# Altium project EDA-02267-V6-0_project.PrjPCB (part 3 of 3)

## Sheet drv_single_channel.SchDoc: Fine Delay FMC
size 297 x 209 mm; CheckedBy: B. Civel; CompanyName: CERN; DrawnBy: TW, GK; Engineer: TW; Organization: CERN; Address1: European Organization for Nuclear Research; Address2: CH-1211 Geneve 23 - Switzerland; DocumentNumber: 10; Revision: -; SheetNumber: 10; SheetTotal: 10; Title2: Single output channel; Projet: Fine Delay FMC (FMCDel1ns4cha); ModifiedBy: B. Civel; CreateDate: 19/01/2012; CheckedDate: 06/06/2013; DivGrp: BE-CO; Designer: TW, GK; EDA_Number: EDA-02267-V6-0; PageSetup: Record=PageOptions|CenterHorizontal=True|CenterVertical=True|PrintScale=0.99|XCorrection=1.00|YCorrection=1.00|PrintKind=0|BorderSize=5000000|LeftOffset=0|BottomOffset=0|Orientation=2|PaperLength=1000|PaperWidth=1000|Scale=100|PaperSource=7|PrintQuality=-4|MediaType=1|DitherType=10|PaperKind=A4|PrintScaleMode=1; ModifiedDate: 16/08/2012
Used 4 times, as channels U_OUTPUT_BUFFER/U_drv_single_channel, U_OUTPUT_BUFFER/U_drv_single_channel, U_OUTPUT_BUFFER/U_drv_single_channel, U_OUTPUT_BUFFER/U_drv_single_channel. Parts and nets are listed once, with the designators drawn on the sheet.
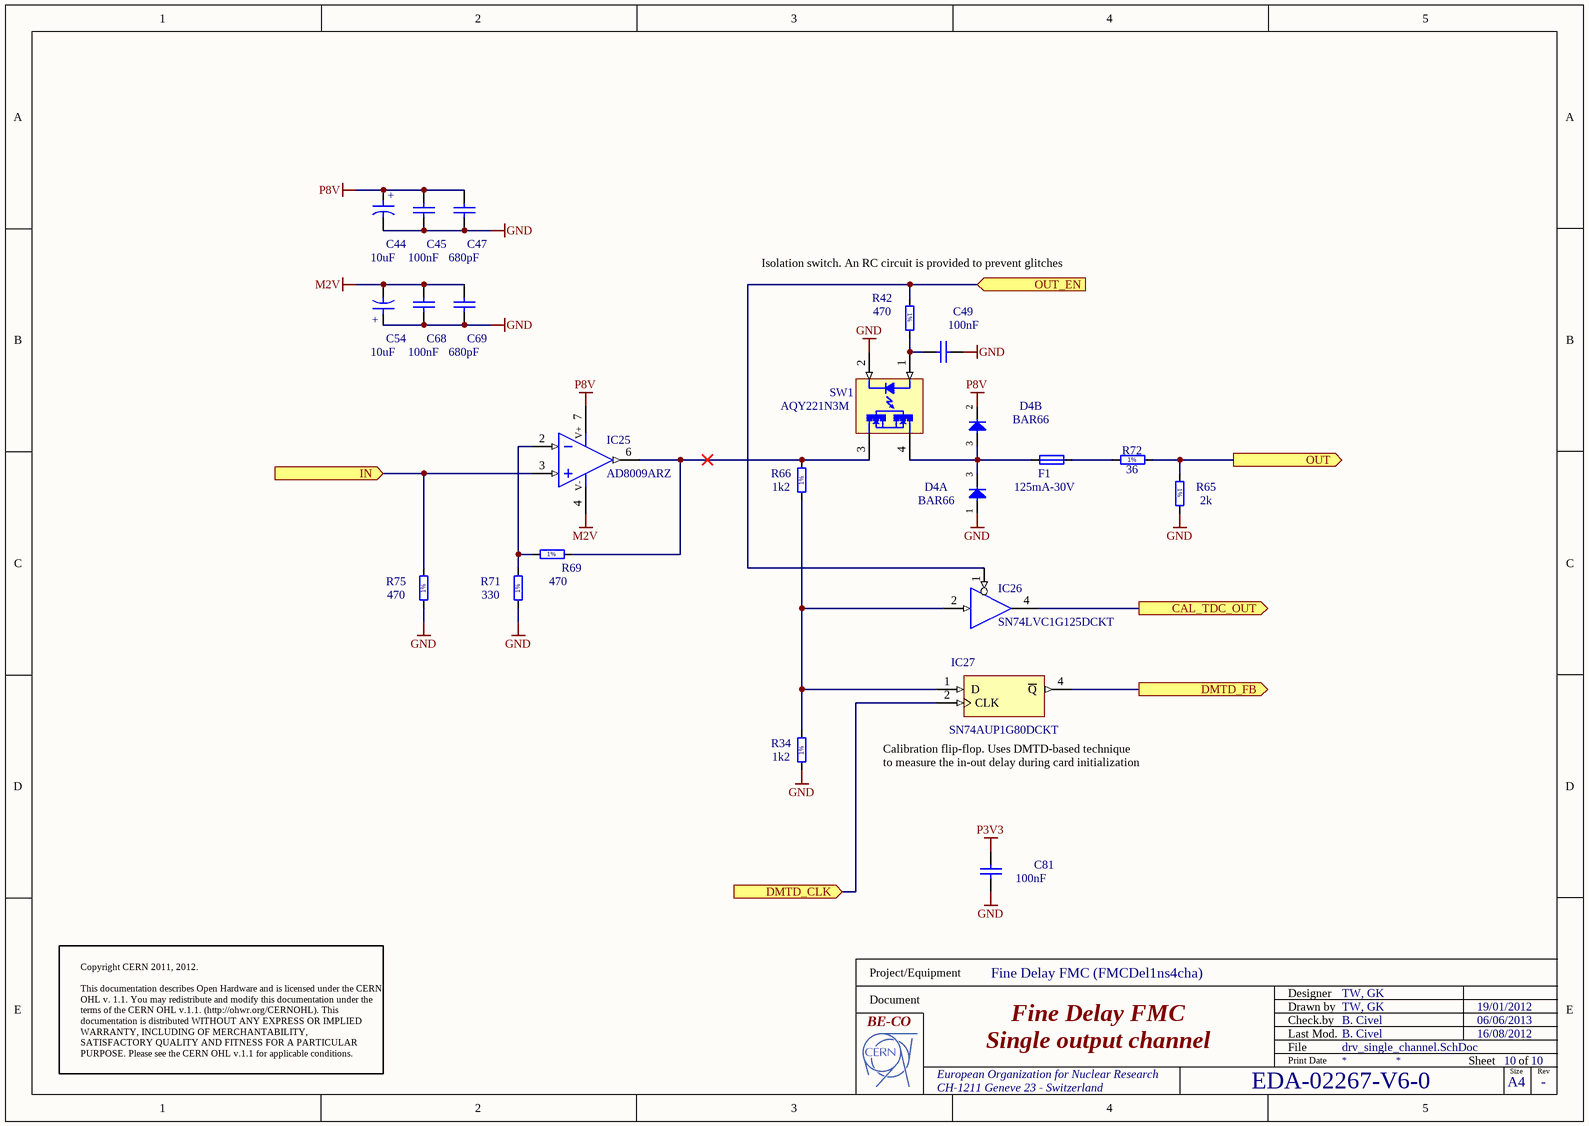
[diagram p7: drv_single_channel.SchDoc]

### Parts
C44  10uF  [CAPMP3528X210N]
C45  100nF  [CAPC1608X87N]
C47  680pF  [CAPC1608X87N]
C49  100nF  [CAPC1608X87N]
C54  10uF  [CAPMP3528X210N]
C68  100nF  [CAPC1608X87N]
C69  680pF  [CAPC1608X87N]
C81  100nF  [CAPC1608X87N]
D4  BAR66  [SOT95P240X110-3N]  (parts A,B of 2)
F1  125mA-30V  [FUSR_LITTELFUSE_1206L012]
IC25  AD8009ARZ  [SOIC127P600X175-8N]
IC26  SN74LVC1G125DCKT  [SOT65P210X110-5N]
IC27  SN74AUP1G80DCKT  [SOT65P210X110-5N]
R34  1k2  [RESC1608X55N]
R42  470  [RESC1608X55N]
R65  2k  [RESC1608X55N]
R66  1k2  [RESC1608X55N]
R69  470  [RESC1608X55N]
R71  330  [RESC1608X55N]
R72  36  [RESC3216X65N]
R75  470  [RESC1608X55N]
SW1  AQY221N3M  [PANASONIC_AQY22(SON)]

### Ports
CAL_TDC_OUT (out), DMTD_CLK (in), DMTD_FB (out), IN (in), OUT (out), OUT_EN (in)

### Nets
GND: C44.2 C45.2 C47.2 C49.1 C54.1 C68.2 C69.2 C81.2 D4.1(A) IC26.3(GND) IC27.3(GND) R34.1 R65.2 R71.1 R75.1 SW1.2(K)
M2V: C54.2 C68.1 C69.1 IC25.4(V-)
P3V3: C81.1 IC26.5(VCC) IC27.5(VCC)
P8V: C44.1 C45.1 C47.1 D4.2(C) IC25.7(V+)
CAL_TDC_OUT: IC26.4(OUT) ; port CAL_TDC_OUT
DMTD_CLK: IC27.2(CLK) ; port DMTD_CLK
DMTD_FB: IC27.4(~{Q}) ; port DMTD_FB
IN: IC25.3(IN+) R75.2 ; port IN
OUT: R65.1 R72.2 ; port OUT
OUT_EN: IC26.1(~{G}) R42.1 ; port OUT_EN
NetC49_2: C49.2 R42.2 SW1.1(A)
NetD4_3: D4.3(COMAC) F1.1 SW1.4(E)
NetF1_2: F1.2 R72.1
NetIC25_2: IC25.2(IN-) R69.1 R71.2
NetIC25_6: IC25.6(OUT) R66.2 R69.2 SW1.3(C)
NetIC26_2: IC26.2(IN) IC27.1(D) R34.2 R66.1

### Channels
U_OUTPUT_BUFFER/U_drv_single_channel: designators end in A; ports CAL_TDC_OUT=TDC_CAL_STOP1 DMTD_CLK=DMTD_CLK_BUF DMTD_FB=NetIC15_2 IN=NetIC1B_6 OUT=NetJ1_1 OUT_EN=OUT_EN1
U_OUTPUT_BUFFER/U_drv_single_channel: designators end in B; ports CAL_TDC_OUT=TDC_CAL_STOP2 DMTD_CLK=DMTD_CLK_BUF DMTD_FB=NetIC15_1 IN=NetIC1B_7 OUT=NetJ2_1 OUT_EN=OUT_EN2
U_OUTPUT_BUFFER/U_drv_single_channel: designators end in C; ports CAL_TDC_OUT=TDC_CAL_STOP3 DMTD_CLK=DMTD_CLK_BUF DMTD_FB=NetIC20_2 IN=NetIC1A_6 OUT=NetJ3_1 OUT_EN=OUT_EN3
U_OUTPUT_BUFFER/U_drv_single_channel: designators end in D; ports CAL_TDC_OUT=TDC_CAL_STOP4 DMTD_CLK=DMTD_CLK_BUF DMTD_FB=NetIC20_1 IN=NetIC1A_7 OUT=NetJ4_1 OUT_EN=OUT_EN4

### Notes on the sheet
- (near R42) Isolation switch. An RC circuit is provided to prevent glitches
- (near IC27) Calibration flip-flop. Uses DMTD-based technique
- to measure the in-out delay during card initialization
- Copyright CERN 2011, 2012.
  This documentation describes Open Hardware and is licensed under the CERN OHL v. 1.1. You may redistribute and modify this documentation under the terms of the CERN OHL v.1.1. (http://ohwr.org/CERNOHL). This documentation is distributed WITHOUT ANY EXPRESS OR IMPLIED WARRANTY, INCLUDING OF MERCHANTABILITY, SATISFACTORY QUALITY AND FITNESS FOR A PARTICULAR PURPOSE. Please see the CERN OHL v.1.1 for applicable conditions.
- Project/Equipment
- Document
- Designer
- Drawn by
- Check.by
- File
- Last Mod.
- Print Date
- Sheet
- Size
- A4
- of
- Rev
- (in symbol CTE3528-21_10UF_16V_20%_SANYO_TQC) +
- (in symbol R0603_1K2_1%_0.1W_100PPM) 1%
- (in symbol R0603_2K_1%_0.1W_100PPM) 1%
- (in symbol R0603_330R_1%_0.1W_100PPM) 1%
- (in symbol R0603_470R_1%_0.1W_100PPM) 1%
- (in symbol R1206_36R_1%_0.25W_100PPM) 1%

### Library data of the parts
C44 C54 = CTE3528-21_10UF_16V_20%_SANYO_TQC: Polarised capacitor; Part Description: ESR 0R1 Solid Tantalum Chip Capacitor; Manufacturer: SANYO; Manufacturer Part Number: 16TQC10M; Voltage: 16V; Tolerance: ±20%; Table: Capacitors SMD; Part Number: CTE3528-21_10UF_16V_20%_SANYO_TQC; Component Kind: Standard; Component Type: Standard; Pin Count: 2; Value: 10uF; Status: None; Case: B; Mounted: Yes; Socket: No; SMD: Yes; ComponentHeight: 2.1mm; HelpURL: \\cern.ch\dfs\Applications\Altium\Datasheets\CTE_SANYO_TQC.pdf; Author: CERN DEM JLC; CreateDate: 6/29/2011; LatestRevisionDate: 6/29/2011
C45 C49 C68 C81 = CC0603_100NF_50V_10%_X7R: Non-polarised capacitor; Part Description: SMD Multilayer Chip Ceramic Capacitor; Manufacturer: GENERIC; Manufacturer1 Part Number: 223858615649; Voltage: 50V; TC: X7R; Tolerance: ±10%; Table: Capacitors SMD; Part Number: CC0603_100NF_50V_10%_X7R; Component Kind: Standard; Component Type: Standard; Pin Count: 2; Value: 100nF; Status: Preferred; Manufacturer Part Number: CC0603_100NF_50V_10%_X7R; Case: 0603; Mounted: Yes; Socket: No; SMD: Yes; Manufacturer1 Example: PHYCOMP; Manufacturer1 ComponentHeight: 0.87mm; HelpURL: \\cern.ch\dfs\Applications\Altium\Datasheets\CC0603_X7R_PHYCOMP.pdf; Author: CERN DEM JLC; CreateDate: 12/3/2007; LatestRevisionDate: 12/3/2007
C47 C69 = CC0603_680PF_50V_5%_NP0: Non-polarised capacitor; Part Description: SMD Multilayer Chip Ceramic Capacitor; Manufacturer: GENERIC; Manufacturer1 Part Number: 223886715681; Voltage: 50V; TC: NP0; Tolerance: ±5%; Table: Capacitors SMD; Part Number: CC0603_680PF_50V_5%_NP0; Component Kind: Standard; Component Type: Standard; Pin Count: 2; Value: 680pF; Status: Preferred; Manufacturer Part Number: CC0603_680PF_50V_5%_NP0; Case: 0603; Mounted: Yes; Socket: No; SMD: Yes; Manufacturer1 Example: PHYCOMP; Manufacturer1 ComponentHeight: 0.87mm; HelpURL: \\cern.ch\dfs\Applications\Altium\Datasheets\CC0603_NP0_PHYCOMP.pdf; Author: CERN DEM JLC; CreateDate: 12/3/2007; LatestRevisionDate: 12/3/2007
D4 = BAR66: Serial Diode; Part Description: Silicon PIN Diode Array (Series Connected); Manufacturer: INFINEON; Voltage: 150V; Power: 250mA; Table: Diodes; Part Number: BAR66; Component Kind: Standard; Component Type: Standard; Device: BAR66; PackageDescription: SOT23 3-Leads, Pitch 0.95mm - Body 1.3x2.9mm, IPC Medium Density; Manufacturer Part Number: BAR66; Pin Count: 3; Mounted: Yes; Socket: No; SMD: Yes; ComponentHeight: 1.1mm; HelpURL: \\cern.ch\dfs\Applications\Altium\Datasheets\BAR66.pdf; Author: CERN DEM JLC; CreateDate: 1/18/2010; LatestRevisionDate: 10/5/2010; Case: SOT23
F1 = FUSR_LITTELFUSE_1206L012: Fuse; Part Description: POLYFUSE® Surface Mount Resettable PTC; Manufacturer Part Number: 1206L012WR; Table: Fuses; Part Number: FUSR_LITTELFUSE_1206L012; Component Kind: Standard; Component Type: Standard; Pin Count: 2; PackageDescription: Surface Mount POLY-FUSE® Resettable PTC, 1206L Series; Family: Fuses Resettable; Mounted: Yes; Socket: No; SMD: Yes; Value: 125mA-30V; Manufacturer: LITTELFUSE; ComponentHeight: 1.45mm; HelpURL: \\cern.ch\dfs\Applications\Altium\Datasheets\FUSR_LITTELFUSE_1206L012.pdf; Author: CERN DEM JLC; CreateDate: 19/12/2011; LatestRevisionDate: 19/12/2011
IC25 = AD8009ARZ: Operational Amplifier; Part Description: 1GHz, 5,500 V/us Low Distortion Amplifier; Manufacturer: ANALOG DEVICES; Table: Operational Amplifiers; Part Number: AD8009ARZ; Component Kind: Standard; Component Type: Standard; Device: AD8009ARZ; PackageDescription: SOIC 8, Pitch 1.27mm - Body 4x5mm, IPC Medium Density; Manufacturer Part Number: AD8009ARZ; Pin Count: 5; Case: SOIC8; Mounted: Yes; Socket: No; SMD: Yes; ComponentHeight: 1.75mm; Author: CERN DEM JLC; HelpURL: \\cern.ch\dfs\Applications\Altium\Datasheets\AD8009ARZ.pdf; CreateDate: 9/29/2010; LatestRevisionDate: 3/24/2011
IC26 = SN74LVC1G125DCKT: Single Bus Buffer Gate With 3-State Output; Manufacturer: TEXAS INSTRUMENTS; Table: Standard Logic; Part Number: SN74LVC1G125DCKT; Component Kind: Standard; Component Type: Standard; Device: SN74LVC1G125DCKT; PackageDescription: SOT353, SC70-5, SOT, 0.65mm Pitch, 5 pin, 1.25mm W X 2.00mm L X 1.10mm H, IPC Medium Density; Part Description: Single Bus Buffer Gate With 3-State Output; Manufacturer Part Number: SN74LVC1G125DCKT; Pin Count: 5; Case: SOT353; Mounted: Yes; Socket: No; SMD: Yes; ComponentHeight: 1.1mm; Author: CERN DEM JLC; HelpURL: \\cern.ch\dfs\Applications\Altium\Datasheets\SN74LVC1G125DCKT.pdf; CreateDate: 12/19/2011; LatestRevisionDate: 12/19/2011
IC27 = SN74AUP1G80DCKT: Single Positive-Edge-Triggered D-Type Flip-Flop; Part Description: Low-Power Single Positive-Edge-Triggered D-Type Flip-Flop; Manufacturer: TEXAS INSTRUMENTS; Table: Standard Logic; Part Number: SN74AUP1G80DCKT; Component Kind: Standard; Component Type: Standard; Device: SN74AUP1G80DCKT; PackageDescription: SOT353, SC70-5, SOT, 0.65mm Pitch, 5 pin, 1.25mm W X 2.00mm L X 1.10mm H, IPC Medium Density; Manufacturer Part Number: SN74AUP1G80DCKT; Pin Count: 5; Case: SOT353; Mounted: Yes; Socket: No; SMD: Yes; ComponentHeight: 1.1mm; Author: CERN DEM JLC; HelpURL: \\cern.ch\dfs\Applications\Altium\Datasheets\SN74AUP1G80DCKT.pdf; CreateDate: 12/19/2011; LatestRevisionDate: 12/19/2011
R34 R66 = R0603_1K2_1%_0.1W_100PPM: Resistor - 1%; Part Description: General Purpose Thick Film Chip Resistor; Manufacturer: GENERIC; Manufacturer1 Part Number: NRC06F1201TRF; Power: 0.1W; TC: ±100ppm/°C; Table: Resistors SMD; Part Number: R0603_1K2_1%_0.1W_100PPM; Component Kind: Standard; Component Type: Standard; Pin Count: 2; Value: 1k2; Status: Preferred; Tolerance: ±1%; Manufacturer Part Number: R0603_1K2_1%_0.1W_100PPM; Case: 0603; Mounted: Yes; Socket: No; SMD: Yes; Manufacturer1 Example: NIC COMPONENT; Manufacturer1 ComponentHeight: 0.55mm; HelpURL: \\cern.ch\dfs\Applications\Altium\Datasheets\R0603_NIC_NRC.pdf; Author: CERN DEM JLC; CreateDate: 12/3/2007; LatestRevisionDate: 3/13/2008
R42 R69 R75 = R0603_470R_1%_0.1W_100PPM: Resistor - 1%; Part Description: General Purpose Thick Film Chip Resistor; Manufacturer: GENERIC; Manufacturer1 Part Number: NRC06F4700TRF; Power: 0.1W; TC: ±100ppm/°C; Table: Resistors SMD; Part Number: R0603_470R_1%_0.1W_100PPM; Component Kind: Standard; Component Type: Standard; Pin Count: 2; Value: 470; Status: Preferred; Tolerance: ±1%; Manufacturer Part Number: R0603_470R_1%_0.1W_100PPM; Case: 0603; Mounted: Yes; Socket: No; SMD: Yes; Manufacturer1 Example: NIC COMPONENT; Manufacturer1 ComponentHeight: 0.55mm; HelpURL: \\cern.ch\dfs\Applications\Altium\Datasheets\R0603_NIC_NRC.pdf; Author: CERN DEM JLC; CreateDate: 12/3/2007; LatestRevisionDate: 3/13/2008
R65 = R0603_2K_1%_0.1W_100PPM: Resistor - 1%; Part Description: General Purpose Thick Film Chip Resistor; Manufacturer: GENERIC; Manufacturer1 Part Number: NRC06F2001TRF; Power: 0.1W; TC: ±100ppm/°C; Table: Resistors SMD; Part Number: R0603_2K_1%_0.1W_100PPM; Component Kind: Standard; Component Type: Standard; Pin Count: 2; Value: 2k; Status: Preferred; Tolerance: ±1%; Manufacturer Part Number: R0603_2K_1%_0.1W_100PPM; Case: 0603; Mounted: Yes; Socket: No; SMD: Yes; Manufacturer1 Example: NIC COMPONENT; Manufacturer1 ComponentHeight: 0.55mm; HelpURL: \\cern.ch\dfs\Applications\Altium\Datasheets\R0603_NIC_NRC.pdf; Author: CERN DEM JLC; CreateDate: 12/3/2007; LatestRevisionDate: 3/13/2008
R71 = R0603_330R_1%_0.1W_100PPM: Resistor - 1%; Part Description: General Purpose Thick Film Chip Resistor; Manufacturer: GENERIC; Manufacturer1 Part Number: NRC06F3300TRF; Power: 0.1W; TC: ±100ppm/°C; Table: Resistors SMD; Part Number: R0603_330R_1%_0.1W_100PPM; Component Kind: Standard; Component Type: Standard; Pin Count: 2; Value: 330; Status: Preferred; Tolerance: ±1%; Manufacturer Part Number: R0603_330R_1%_0.1W_100PPM; Case: 0603; Mounted: Yes; Socket: No; SMD: Yes; Manufacturer1 Example: NIC COMPONENT; Manufacturer1 ComponentHeight: 0.55mm; HelpURL: \\cern.ch\dfs\Applications\Altium\Datasheets\R0603_NIC_NRC.pdf; Author: CERN DEM JLC; CreateDate: 12/3/2007; LatestRevisionDate: 3/13/2008
R72 = R1206_36R_1%_0.25W_100PPM: Resistor - 1%; Part Description: General Purpose Thick Film Chip Resistor; Manufacturer: GENERIC; Manufacturer1 Part Number: NRC12F36R0TRF; Power: 0.25W; TC: ±100ppm/°C; Table: Resistors SMD; Part Number: R1206_36R_1%_0.25W_100PPM; Component Kind: Standard; Component Type: Standard; Pin Count: 2; Value: 36; Status: Preferred; Tolerance: ±1%; Manufacturer Part Number: R1206_36R_1%_0.25W_100PPM; Case: 1206; Mounted: Yes; Socket: No; SMD: Yes; Manufacturer1 Example: NIC COMPONENT; Manufacturer1 ComponentHeight: 0.65mm; HelpURL: \\cern.ch\dfs\Applications\Altium\Datasheets\R1206_NIC_NRC.pdf; Author: CERN DEM JLC; CreateDate: 12/3/2007; LatestRevisionDate: 3/13/2008
SW1 = AQY221N3M: PhotoMOS Relay; Part Description: Micro-miniature SON Package Lower Output Capacitance and On Resistance (C×R5) 25V Load Voltage PhotoMOS Relay; Manufacturer: PANASONIC ELECTRIC WORKS; Table: Optocouplers; Part Number: AQY221N3M; Component Kind: Standard; Component Type: Standard; Device: AQY221N3M; PackageDescription: PANASONIC Serie AQY22(SON)  Small Outline No Lead, 4 pins, 2.2x2.95mm; Manufacturer Part Number: AQY221N3M; Pin Count: 4; Case: SON4; Mounted: Yes; Socket: No; SMD: Yes; ComponentHeight: 1.4mm; HelpURL: \\cern.ch\dfs\Applications\Altium\Datasheets\AQY221N3M.pdf; ComponentLink1Description: Package Drawing; ComponentLink1URL: \\cern.ch\dfs\Applications\Altium\Datasheets\AQY221N3M_Package-Drawing.pdf; Author: CERN DEM JLC; CreateDate: 1/18/2010; LatestRevisionDate: 1/18/2010

## Sheet input_stage.SchDoc: Fine Delay FMC
size 297 x 209 mm; CheckedBy: B. Civel; CompanyName: CERN; DrawnBy: TW, GK; Engineer: TW; Organization: CERN; Address1: European Organization for Nuclear Research; Address2: CH-1211 Geneve 23 - Switzerland; DocumentNumber: 6; Revision: -; SheetNumber: 6; SheetTotal: 10; ModifiedBy: B. Civel; CreateDate: 19/01/2012; CheckedDate: 06/06/2013; Title2: Input stage logic; Designer: TW, GK; EDA_Number: EDA-02267-V6-0; Projet: Fine Delay FMC (FMCDel1ns4cha); DivGrp: BE-CO; ModifiedDate: 16/08/2012
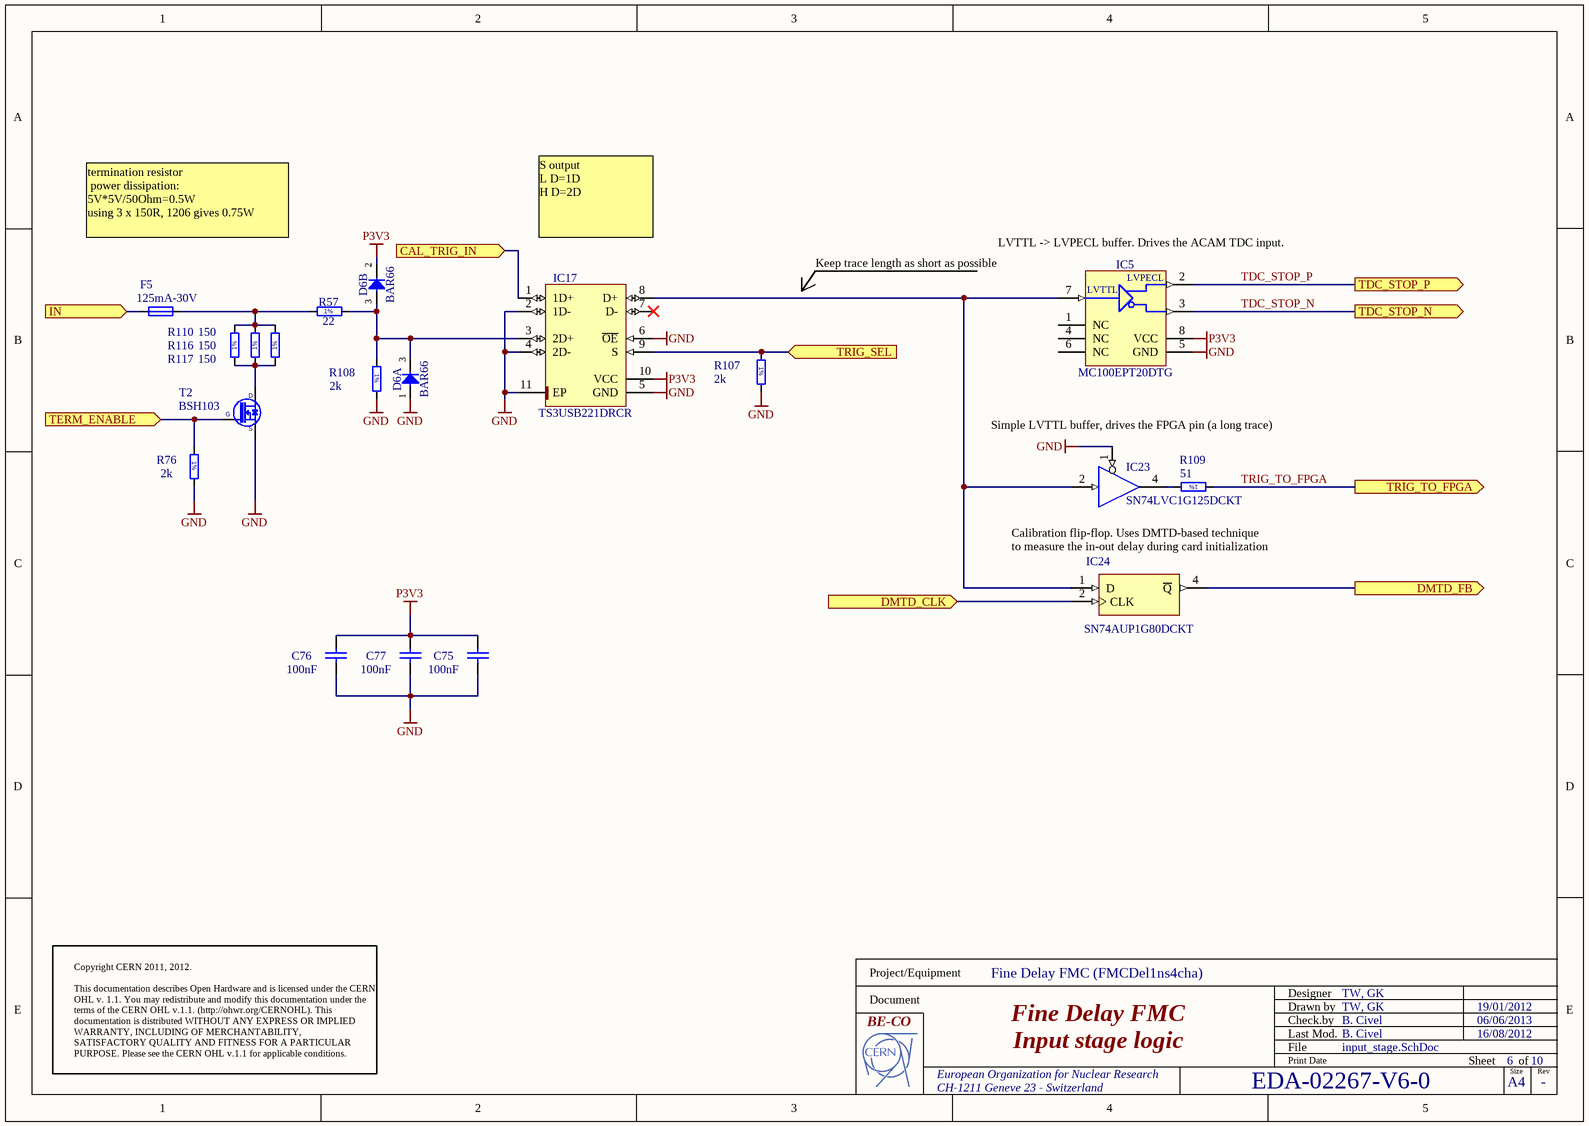
[diagram p8: input_stage.SchDoc]

### Parts
C75  100nF  [CAPC1608X87N]
C76  100nF  [CAPC1608X87N]
C77  100nF  [CAPC1608X87N]
D6  BAR66  [SOT95P240X110-3N]  (parts A,B of 2)
F5  125mA-30V  [FUSR_LITTELFUSE_1206L012]
IC5  MC100EPT20DTG  [SOP65P490X110-8N]
IC17  TS3USB221DRCR  [TEXAS_DRC (S-PVSON-N10)]
IC23  SN74LVC1G125DCKT  [SOT65P210X110-5N]
IC24  SN74AUP1G80DCKT  [SOT65P210X110-5N]
R57  22  [RESC1608X55N]
R76  2k  [RESC1608X55N]
R107  2k  [RESC1608X55N]
R108  2k  [RESC1608X55N]
R109  51  [RESC1608X55N]
R110  150  [RESC3216X65N]
R116  150  [RESC3216X65N]
R117  150  [RESC3216X65N]
T2  BSH103  [SOT95P230X110-3N]

### Ports
CAL_TRIG_IN (in), DMTD_CLK (in), DMTD_FB (out), IN (in), TDC_STOP_N (out), TDC_STOP_P (out), TERM_ENABLE (in), TRIG_SEL (in), TRIG_TO_FPGA (out)

### Nets
GND: C75.2 C76.2 C77.2 D6.1(A) IC5.5(GND) IC17.2(1D-) IC17.4(2D-) IC17.5(GND) IC17.6(~{OE}) IC17.11(EP) IC23.1(~{G}) IC23.3(GND) IC24.3(GND) R76.2 R107.2 R108.2 T2.2(S)
P3V3: C75.1 C76.1 C77.1 D6.2(C) IC5.8(VCC) IC17.10(VCC) IC23.5(VCC) IC24.5(VCC)
CAL_PULSE_BUF: IC17.1(1D+) ; port CAL_TRIG_IN
DMTD_CLK_BUF: IC24.2(CLK) ; port DMTD_CLK
DMTD_FB_IN: IC24.4(~{Q}) ; port DMTD_FB
TDC_STOP_N: IC5.3(~{Q}) ; port TDC_STOP_N
TDC_STOP_P: IC5.2(Q) ; port TDC_STOP_P
TERM_ENABLE: R76.1 T2.1(G) ; port TERM_ENABLE
TRIG_SEL: IC17.9(S) R107.1 ; port TRIG_SEL
TRIG_TO_FPGA: R109.1 ; port TRIG_TO_FPGA
NetD6_3: D6.3(COMAC) IC17.3(2D+) R57.2 R108.1
NetF5_1: F5.1 ; port IN
NetF5_2: F5.2 R57.1 R110.2 R116.2 R117.2
NetIC5_7: IC5.7(D) IC17.8(D+) IC23.2(IN) IC24.1(D)
NetIC23_4: IC23.4(OUT) R109.2
NetR110_1: R110.1 R116.1 R117.1 T2.3(D)

Not connected (* = marked no-connect by the designer): IC5 1(NC) 4(NC) 6(NC); IC17 7(D-)*

### Notes on the sheet
- termination resistor
  power dissipation:
  5V*5V/50Ohm=0.5W
  using 3 x 150R, 1206 gives 0.75W
- S	output
  L	D=1D
  H	D=2D
- (near IC5) Keep trace length as short as possible
- (near IC5) LVTTL -> LVPECL buffer. Drives the ACAM TDC input.
- Simple LVTTL buffer, drives the FPGA pin (a long trace)
- Calibration flip-flop. Uses DMTD-based technique
- to measure the in-out delay during card initialization
- Copyright CERN 2011, 2012.
  This documentation describes Open Hardware and is licensed under the CERN OHL v. 1.1. You may redistribute and modify this documentation under the terms of the CERN OHL v.1.1. (http://ohwr.org/CERNOHL). This documentation is distributed WITHOUT ANY EXPRESS OR IMPLIED WARRANTY, INCLUDING OF MERCHANTABILITY, SATISFACTORY QUALITY AND FITNESS FOR A PARTICULAR PURPOSE. Please see the CERN OHL v.1.1 for applicable conditions.
- Project/Equipment
- Document
- Designer
- Drawn by
- Check.by
- File
- Last Mod.
- Print Date
- Sheet
- Size
- A4
- of
- Rev
- (in symbol MC100EPT20DTG) LVPECL; LVTTL
- (in symbol R0603_2K_1%_0.1W_100PPM) 1%
- (in symbol R0603_22R_1%_0.1W_100PPM) 1%
- (in symbol R0603_51R_1%_0.1W_100PPM) 1%
- (in symbol R1206_150R_1%_0.25W_100PPM) 1%

### Library data of the parts
C75-C77 = CC0603_100NF_50V_10%_X7R: as C45 on sheet drv_single_channel; Part Number: CC0603_100NF_50V_10%_X7R; Component Kind: Standard; Component Type: Standard; Pin Count: 2; Value: 100nF; Status: Preferred; Manufacturer Part Number: CC0603_100NF_50V_10%_X7R; Case: 0603; Mounted: Yes; Socket: No; SMD: Yes; Manufacturer1 Example: PHYCOMP; Manufacturer1 ComponentHeight: 0.87mm; HelpURL: \\cern.ch\dfs\Applications\Altium\Datasheets\CC0603_X7R_PHYCOMP.pdf; Author: CERN DEM JLC; CreateDate: 12/3/2007; LatestRevisionDate: 12/3/2007
D6 = BAR66: as D4 on sheet drv_single_channel; Part Number: BAR66; Component Kind: Standard; Component Type: Standard; Device: BAR66; PackageDescription: SOT23 3-Leads, Pitch 0.95mm - Body 1.3x2.9mm, IPC Medium Density; Manufacturer Part Number: BAR66; Pin Count: 3; Case: SOT23; Mounted: Yes; Socket: No; SMD: Yes; ComponentHeight: 1.1mm; HelpURL: \\cern.ch\dfs\Applications\Altium\Datasheets\BAR66.pdf; Author: CERN DEM JLC; CreateDate: 18/01/2010; LatestRevisionDate: 05/10/2010
F5 = FUSR_LITTELFUSE_1206L012: as F1 on sheet drv_single_channel; Part Number: FUSR_LITTELFUSE_1206L012; Component Kind: Standard; Component Type: Standard; Pin Count: 2; PackageDescription: Surface Mount POLY-FUSE® Resettable PTC, 1206L Series; Family: Fuses Resettable; Mounted: Yes; Socket: No; SMD: Yes; Value: 125mA-30V; Manufacturer: LITTELFUSE; ComponentHeight: 1.45mm; HelpURL: \\cern.ch\dfs\Applications\Altium\Datasheets\FUSR_LITTELFUSE_1206L012.pdf; Author: CERN DEM JLC; CreateDate: 19/12/2011; LatestRevisionDate: 19/12/2011
IC5 = MC100EPT20DTG: 3.3V LVTTL/LVCMOS to Differential LVPECL Translator; Manufacturer: ON SEMICONDUCTOR; Table: Standard Logic; Part Number: MC100EPT20DTG; Component Kind: Standard; Component Type: Standard; Device: MC100EPT20DTG; PackageDescription: SOP, 0.65mm pitch; 8 pin, 3.00mm W X 3.00mm L X 1.10mm H body, IPC Medium Density; Part Description: 3.3V LVTTL/LVCMOS To Differential LVPECL Translator; Manufacturer Part Number: MC100EPT20DTG; Pin Count: 8; Case: SOIC8; Mounted: Yes; Socket: No; SMD: Yes; ComponentHeight: 1.1mm; Author: CERN DEM JLC; HelpURL: \\cern.ch\dfs\Applications\Altium\Datasheets\MC100EPT20DTG.pdf; CreateDate: 7/5/2010; LatestRevisionDate: 7/5/2010
IC17 = TS3USB221DRCR: High-Speed USB 2.0 (480-Mbps) 1:2 Multiplexer/Demultiplexer Switch With Single Enable; Manufacturer: TEXAS INSTRUMENTS; Table: Analog & Interface; Part Number: TS3USB221DRCR; Component Kind: Standard; Component Type: Standard; Device: TS3USB221DRCR; PackageDescription: SON, TEXAS DRC (S-PVSON-N10), 0.50mm Pitch, 10-pin, 3.00mm W  X 3.00mm L X 1.00mm Height, (w/thermal tab 1.65 X 2.40 mm); Part Description: High-Speed USB 2.0 (480-Mbps) 1:2 Multiplexer/Demultiplexer Switch With Single Enable; Manufacturer Part Number: TS3USB221DRCR; Pin Count: 11; Case: SON10; Mounted: Yes; Socket: No; SMD: Yes; ComponentHeight: 1mm; Author: CERN DEM JLC; HelpURL: \\cern.ch\dfs\Applications\Altium\Datasheets\TS3USB221DRCR.pdf; CreateDate: 25/08/2010; LatestRevisionDate: 06/11/2013
IC23 = SN74LVC1G125DCKT: as IC26 on sheet drv_single_channel; Part Number: SN74LVC1G125DCKT; Component Kind: Standard; Component Type: Standard; Device: SN74LVC1G125DCKT; PackageDescription: SOT353, SC70-5, SOT, 0.65mm Pitch, 5 pin, 1.25mm W X 2.00mm L X 1.10mm H, IPC Medium Density; Part Description: Single Bus Buffer Gate With 3-State Output; Manufacturer Part Number: SN74LVC1G125DCKT; Pin Count: 5; Case: SOT353; Mounted: Yes; Socket: No; SMD: Yes; ComponentHeight: 1.1mm; Author: CERN DEM JLC; HelpURL: \\cern.ch\dfs\Applications\Altium\Datasheets\SN74LVC1G125DCKT.pdf; CreateDate: 12/19/2011; LatestRevisionDate: 12/19/2011
IC24 = SN74AUP1G80DCKT: as IC27 on sheet drv_single_channel; Part Number: SN74AUP1G80DCKT; Component Kind: Standard; Component Type: Standard; Device: SN74AUP1G80DCKT; PackageDescription: SOT353, SC70-5, SOT, 0.65mm Pitch, 5 pin, 1.25mm W X 2.00mm L X 1.10mm H, IPC Medium Density; Manufacturer Part Number: SN74AUP1G80DCKT; Pin Count: 5; Case: SOT353; Mounted: Yes; Socket: No; SMD: Yes; ComponentHeight: 1.1mm; Author: CERN DEM JLC; HelpURL: \\cern.ch\dfs\Applications\Altium\Datasheets\SN74AUP1G80DCKT.pdf; CreateDate: 12/19/2011; LatestRevisionDate: 12/19/2011
R57 = R0603_22R_1%_0.1W_100PPM: Resistor - 1%; Part Description: General Purpose Thick Film Chip Resistor; Manufacturer: GENERIC; Manufacturer1 Part Number: NRC06F22R0TRF; Power: 0.1W; TC: ±100ppm/°C; Table: Resistors SMD; Part Number: R0603_22R_1%_0.1W_100PPM; Component Kind: Standard; Component Type: Standard; Pin Count: 2; Value: 22; Status: Preferred; Tolerance: ±1%; Manufacturer Part Number: R0603_22R_1%_0.1W_100PPM; Case: 0603; Mounted: Yes; Socket: No; SMD: Yes; Manufacturer1 Example: NIC COMPONENT; Manufacturer1 ComponentHeight: 0.55mm; HelpURL: \\cern.ch\dfs\Applications\Altium\Datasheets\R0603_NIC_NRC.pdf; Author: CERN DEM JLC; CreateDate: 03/12/2007; LatestRevisionDate: 13/03/2008
R76 R107 R108 = R0603_2K_1%_0.1W_100PPM: as R65 on sheet drv_single_channel; Part Number: R0603_2K_1%_0.1W_100PPM; Component Kind: Standard; Component Type: Standard; Pin Count: 2; Value: 2k; Status: Preferred; Tolerance: ±1%; Manufacturer Part Number: R0603_2K_1%_0.1W_100PPM; Case: 0603; Mounted: Yes; Socket: No; SMD: Yes; Manufacturer1 Example: NIC COMPONENT; Manufacturer1 ComponentHeight: 0.55mm; HelpURL: \\cern.ch\dfs\Applications\Altium\Datasheets\R0603_NIC_NRC.pdf; Author: CERN DEM JLC; CreateDate: 12/3/2007; LatestRevisionDate: 3/13/2008
R109 = R0603_51R_1%_0.1W_100PPM: as R1-R8 on sheet delay_channel; Part Number: R0603_51R_1%_0.1W_100PPM; Component Kind: Standard; Component Type: Standard; Pin Count: 2; Value: 51; Status: Preferred; Tolerance: ±1%; Manufacturer Part Number: R0603_51R_1%_0.1W_100PPM; Case: 0603; Mounted: Yes; Socket: No; SMD: Yes; Manufacturer1 Example: NIC COMPONENT; Manufacturer1 ComponentHeight: 0.55mm; HelpURL: \\cern.ch\dfs\Applications\Altium\Datasheets\R0603_NIC_NRC.pdf; Author: CERN DEM JLC; CreateDate: 12/3/2007; LatestRevisionDate: 3/13/2008
R110 R116 R117 = R1206_150R_1%_0.25W_100PPM: Resistor - 1%; Part Description: General Purpose Thick Film Chip Resistor; Manufacturer: GENERIC; Manufacturer1 Part Number: NRC12F1500TRF; Power: 0.25W; TC: ±100ppm/°C; Table: Resistors SMD; Part Number: R1206_150R_1%_0.25W_100PPM; Component Kind: Standard; Component Type: Standard; Pin Count: 2; Value: 150; Status: Preferred; Tolerance: ±1%; Manufacturer Part Number: R1206_150R_1%_0.25W_100PPM; Case: 1206; Mounted: Yes; Socket: No; SMD: Yes; Manufacturer1 Example: NIC COMPONENT; Manufacturer1 ComponentHeight: 0.65mm; HelpURL: \\cern.ch\dfs\Applications\Altium\Datasheets\R1206_NIC_NRC.pdf; Author: CERN DEM JLC; CreateDate: 12/3/2007; LatestRevisionDate: 3/13/2008
T2 = BSH103: N-CHANNEL MOSFET WITH DIODE; Part Description: 30V 850mA N-Channel Enhancement Mode Field-Effect Transistor; Manufacturer: NXP SEMICONDUCTORS; Table: Transistors; Part Number: BSH103; Component Kind: Standard; Component Type: Standard; Device: BSH103; PackageDescription: SOT23, 3 pin, Pitch 0.95mm - 1.3mm W X 2.9mm L X 1.1mm H, IPC Medium Density; Manufacturer Part Number: BSH103; Pin Count: 3; Case: SOT23-3; Mounted: Yes; Socket: No; SMD: Yes; ComponentHeight: 1.1mm; HelpURL: \\cern.ch\dfs\Applications\Altium\Datasheets\BSH103.pdf; Author: CERN DEM JLC; CreateDate: 3/16/2010; LatestRevisionDate: 2/1/2012

## Sheet leds_mem_sensor.SchDoc: Fine Delay FMC
size 297 x 209 mm; CheckedBy: B. Civel; CompanyName: CERN; DrawnBy: TW, GK; Engineer: TW; Organization: CERN; Address1: European Organization for Nuclear Research; Address2: CH-1211 Geneve 23 - Switzerland; DocumentNumber: 4; Revision: -; SheetNumber: 4; SheetTotal: 10; ModifiedBy: B. Civel; CreateDate: 18/01/2012; CheckedDate: 06/06/2013; Title2: LEDs, sensors and ID EEPROM; Designer: TW, GK; EDA_Number: EDA-02267-V6-1; Projet: Fine Delay FMC (FMCDel1ns4cha); DivGrp: BE-CO; ModifiedDate: 16/08/2012
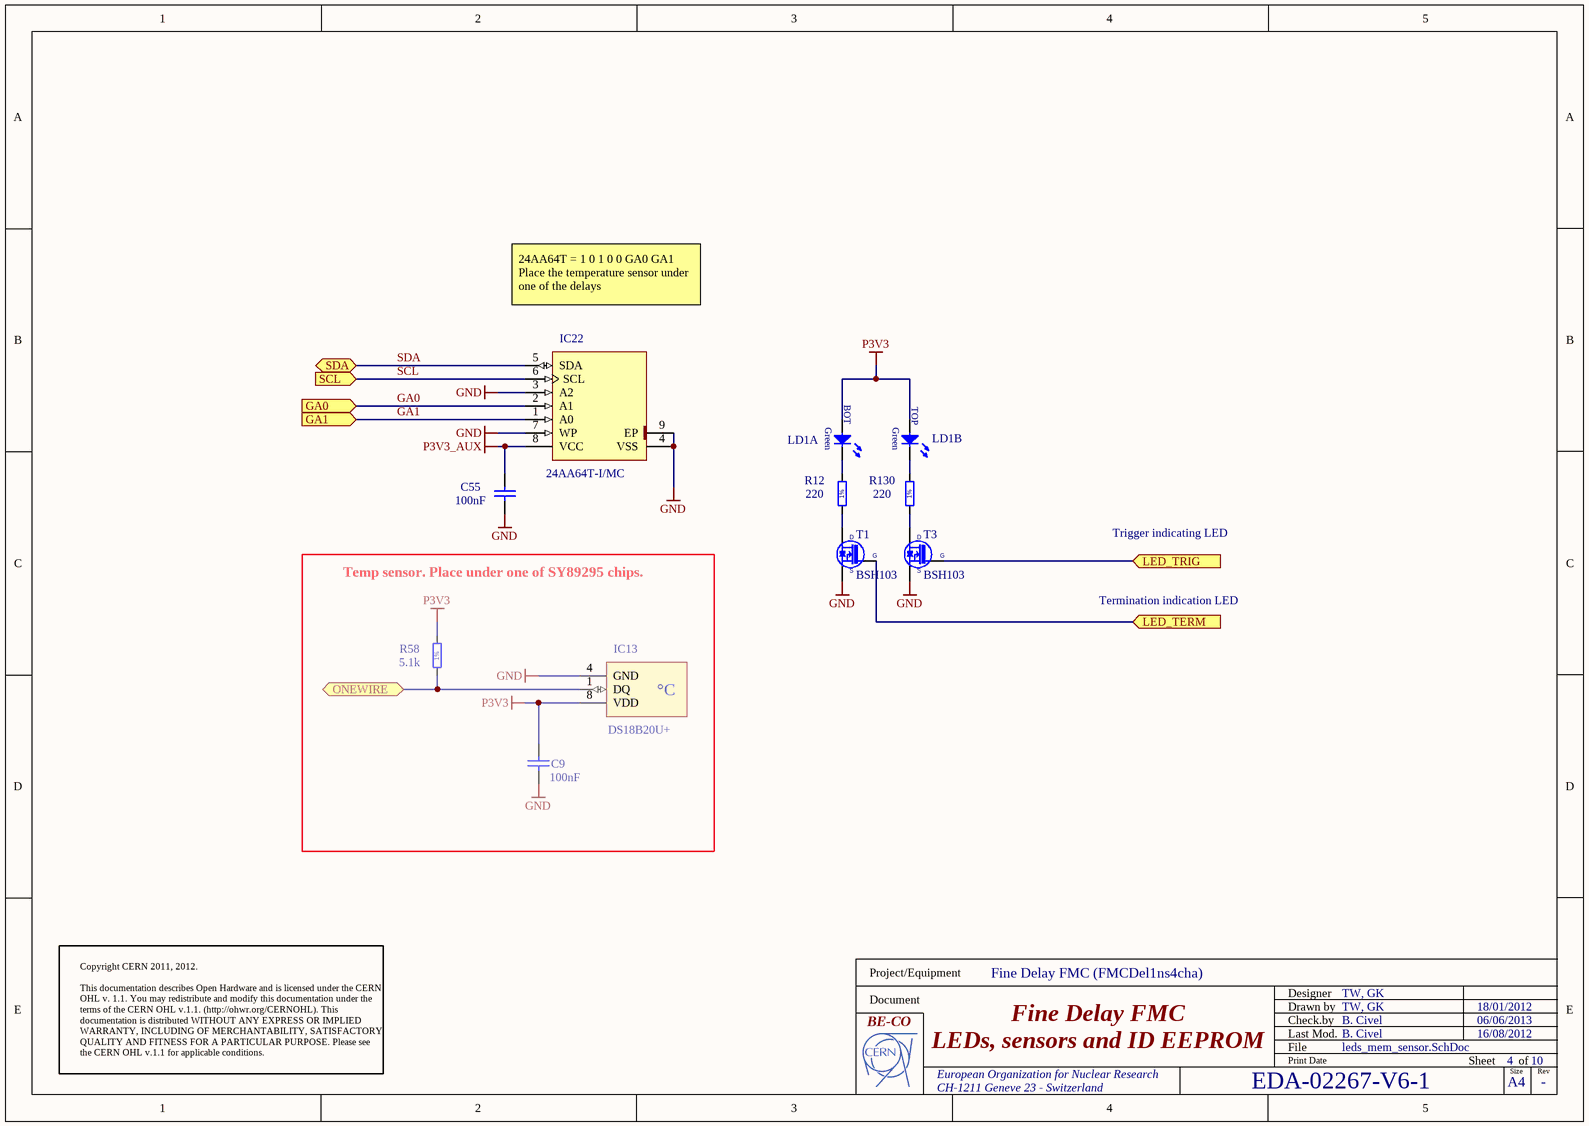
[diagram p9: leds_mem_sensor.SchDoc]

### Parts
C9  100nF  [CAPC1608X87N]
C55  100nF  [CAPC1608X87N]
IC13  DS18B20U+  [SOP65P490X110-8N]
IC22  24AA64T-I/MC  [SON50P300X200X100-9N-S175X155]
LD1  Green/Green  [LED_DIALIGHT_571-0122-100F]  (value not drawn)  (parts A,B of 2)
R12  220  [RESC1608X55N]
R58  5.1k  [RESC1608X55N]
R130  220  [RESC1608X55N]
T1  BSH103  [SOT95P230X110-3N]
T3  BSH103  [SOT95P230X110-3N]

### Blocks framed on the sheet
Temp sensor. Place under one of SY89295 chips.: C9 IC13 R58

### Ports
GA0 (in), GA1 (in), LED_TERM (in), LED_TRIG (in), ONEWIRE (bidir), SCL (in), SDA (bidir)

### Nets
GND: C9.2 C55.2 IC13.4(GND) IC22.3(A2) IC22.4(VSS) IC22.7(WP) IC22.9(EP) T1.2(S) T3.2(S)
P3V3: C9.1 IC13.8(VDD) LD1.2(A) LD1.4(A) R58.2
P3V3_AUX: C55.1 IC22.8(VCC)
GA0: IC22.2(A1) ; port GA0
GA1: IC22.1(A0) ; port GA1
SCL: IC22.6(SCL) ; port SCL
SDA: IC22.5(SDA) ; port SDA
TERM_ENABLE: T1.1(G) ; port LED_TERM
NetIC13_1: IC13.1(DQ) R58.1 ; port ONEWIRE
NetJ6_h19: T3.1(G) ; port LED_TRIG
NetLD1_1: LD1.1(C) R12.2
NetLD1_3: LD1.3(C) R130.2
NetR12_1: R12.1 T1.3(D)
NetR130_1: R130.1 T3.3(D)

### Notes on the sheet
- 24AA64T = 1 0 1 0 0 GA0 GA1
  Place the temperature sensor under one of the delays
- Trigger indicating LED
- Termination indication LED
- Copyright CERN 2011, 2012.
  This documentation describes Open Hardware and is licensed under the CERN OHL v. 1.1. You may redistribute and modify this documentation under the terms of the CERN OHL v.1.1. (http://ohwr.org/CERNOHL). This documentation is distributed WITHOUT ANY EXPRESS OR IMPLIED WARRANTY, INCLUDING OF MERCHANTABILITY, SATISFACTORY QUALITY AND FITNESS FOR A PARTICULAR PURPOSE. Please see the CERN OHL v.1.1 for applicable conditions.
- Project/Equipment
- Document
- Designer
- Drawn by
- Check.by
- File
- Last Mod.
- Print Date
- Sheet
- Size
- A4
- of
- Rev
- (in symbol DS18B20U+) °C
- (in symbol LED_DIALIGHT_571-0122-100F, part A) BOT; Green
- (in symbol LED_DIALIGHT_571-0122-100F, part B) TOP; Green
- (in symbol R0603_5K1_1%_0.1W_100PPM) 1%
- (in symbol R0603_220R_1%_0.1W_100PPM) 1%

### Library data of the parts
C9 C55 = CC0603_100NF_50V_10%_X7R: as C45 on sheet drv_single_channel; Part Number: CC0603_100NF_50V_10%_X7R; Component Kind: Standard; Component Type: Standard; Pin Count: 2; Value: 100nF; Status: Preferred; Manufacturer Part Number: CC0603_100NF_50V_10%_X7R; Case: 0603; Mounted: Yes; Socket: No; SMD: Yes; Manufacturer1 Example: PHYCOMP; Manufacturer1 ComponentHeight: 0.87mm; HelpURL: \\cern.ch\dfs\Applications\Altium\Datasheets\CC0603_X7R_PHYCOMP.pdf; Author: CERN DEM JLC; CreateDate: 03/12/2007; LatestRevisionDate: 03/12/2007
IC13 = DS18B20U+: Programmable Resolution 1-Wire Digital Thermometer; Part Description: Programmable Resolution 1-Wire Digital Thermometer (-55°C to +125°C); Manufacturer: DALLAS MAXIM; Table: Sensors; PressFit: No; Bonding: No; Part Number: DS18B20U+; Component Kind: Standard; Component Type: Standard; Device: DS18B20U+; PackageDescription: SOP, 0.65mm pitch; 8 pin, 3.00mm W X 3.00mm L X 1.10mm H body, IPC Medium Density; Manufacturer Part Number: DS18B20U+; Pin Count: 3; Case: uSOP8; Mounted: Yes; Socket: No; SMD: Yes; ComponentHeight: 1.1mm; HelpURL: \\cern.ch\dfs\Applications\Altium\Datasheets\DS18B20U+.pdf; Author: CERN DEM JLC; CreateDate: 17/03/2010; LatestRevisionDate: 02/05/2011
IC22 = 24AA64T-I/MC: 1.7-5.5V 64K I2C Serial EEPROM; Part Description: 1.7V-5.5V, 64K  (8K x 8-bit) I2C Serial EEPROM; Manufacturer: MICROCHIP TECHNOLOGY; Table: Logic; PressFit: No; Bonding: No; Part Number: 24AA64T-I/MC; Component Kind: Standard; Component Type: Standard; Device: 24AA64T-I/MC; PackageDescription: SON (DFN), 0.50mm pitch, 8 pin, 2mm X 3mm X 1.00mm H body (w/thermal tab 1.75 X 1.55mm),  IPC Medium Density; Manufacturer Part Number: 24AA64T-I/MC; Pin Count: 9; Case: DFN8; Mounted: Yes; Socket: No; SMD: Yes; ComponentHeight: 1.0mm; HelpURL: \\cern.ch\dfs\Applications\Altium\Datasheets\24AA64T-I-MC.pdf; Author: CERN DEM JLC; CreateDate: 18/11/2009; LatestRevisionDate: 24/01/2011
LD1 = LED_DIALIGHT_571-0122-100F: LED x2 Green 1C2A-BOT_3C4A-TOP; Part Description: Dual 2mm Green LEDs CBI® Circuit Board Indicator (With positioning pins); Table: LEDs & Displays; PressFit: No; Bonding: No; Part Number: LED_DIALIGHT_571-0122-100F; Component Kind: Standard; Component Type: Standard; Color: Green/Green; PackageDescription: 2x 2mm Red LED PCB Edge Mounting (With positioning pins) DIALIGHT 571 Serie; Manufacturer: DIALIGHT; Manufacturer Part Number: 571-0122-100F; Pin Count: 4; Mounted: Yes; Socket: No; SMD: No; ComponentHeight: 8.6mm; HelpURL: \\cern.ch\dfs\Applications\Altium\Datasheets\LED_DIALIGHT_571-0122-100F.pdf; Author: CERN DEM JLC; CreateDate: 05/11/2009; LatestRevisionDate: 17/03/2010
R12 R130 = R0603_220R_1%_0.1W_100PPM: Resistor - 1%; Part Description: General Purpose Thick Film Chip Resistor; Manufacturer: GENERIC; Manufacturer1 Part Number: NRC06F2200TRF; Power: 0.1W; TC: ±100ppm/°C; Table: Resistors SMD; Part Number: R0603_220R_1%_0.1W_100PPM; Component Kind: Standard; Component Type: Standard; Pin Count: 2; Value: 220; Status: Preferred; Tolerance: ±1%; Manufacturer Part Number: R0603_220R_1%_0.1W_100PPM; Case: 0603; Mounted: Yes; Socket: No; SMD: Yes; Manufacturer1 Example: NIC COMPONENT; Manufacturer1 ComponentHeight: 0.55mm; HelpURL: \\cern.ch\dfs\Applications\Altium\Datasheets\R0603_NIC_NRC.pdf; Author: CERN DEM JLC; CreateDate: 12/3/2007; LatestRevisionDate: 3/13/2008
R58 = R0603_5K1_1%_0.1W_100PPM: Resistor - 1%; Part Description: General Purpose Thick Film Chip Resistor; Manufacturer: GENERIC; Manufacturer1 Part Number: NRC06F5101TRF; Value: 5k1; Power: 0.1W; TC: ±100ppm/°C; Table: Resistors SMD; Part Number: R0603_5K1_1%_0.1W_100PPM; Component Kind: Standard; Component Type: Standard; Designator: Resistor - 1%; Library Reference: Resistor - 1%; Pin Count: 2; Status: Preferred; Tolerance: ±1%; Manufacturer Part Number: R0603_5K1_1%_0.1W_100PPM; Case: 0603; Mounted: Yes; Socket: No; SMD: Yes; Manufacturer1 Example: NIC COMPONENT; Manufacturer1 ComponentHeight: 0.55mm; HelpURL: \\cern.ch\dfs\Applications\Altium\Datasheets\R0603_NIC_NRC.pdf; Author: CERN DEM JLC; CreateDate: 12/3/2007; LatestRevisionDate: 3/13/2008
T1 T3 = BSH103: N-CHANNEL MOSFET WITH DIODE; Part Description: 30V 850mA N-Channel Enhancement Mode Field-Effect Transistor; Manufacturer: NXP SEMICONDUCTORS; Table: Transistors; PressFit: No; Bonding: No; Part Number: BSH103; Component Kind: Standard; Component Type: Standard; Device: BSH103; PackageDescription: SOT23, 3 pin, Pitch 0.95mm - 1.3mm W X 2.9mm L X 1.1mm H, IPC Medium Density; Manufacturer Part Number: BSH103; Pin Count: 3; Case: SOT23-3; Mounted: Yes; Socket: No; SMD: Yes; ComponentHeight: 1.1mm; HelpURL: \\cern.ch\dfs\Applications\Altium\Datasheets\BSH103.pdf; Author: CERN DEM JLC; CreateDate: 16/03/2010; LatestRevisionDate: 01/02/2012

## Nets that join several sheets
GND: FMC_Delay_1ns_4Cha (23 pins), clock_generator (27 pins), fmc_connector (75 pins), power_supply (18 pins), acam_tdc (50 pins), U_CHANNEL_DELAY (36 pins), U_CHANNEL_DELAY (36 pins), output_driver (6 pins), U_OUTPUT_BUFFER/U_drv_single_channel (16 pins), U_OUTPUT_BUFFER/U_drv_single_channel (16 pins), U_OUTPUT_BUFFER/U_drv_single_channel (16 pins), U_OUTPUT_BUFFER/U_drv_single_channel (16 pins), input_stage (17 pins), leds_mem_sensor (9 pins)
M2V: power_supply (C41.1 C43.2 L4.2 R44.2), U_OUTPUT_BUFFER/U_drv_single_channel (C54A.2 C68A.1 C69A.1 IC25A.4), U_OUTPUT_BUFFER/U_drv_single_channel (C54B.2 C68B.1 C69B.1 IC25B.4), U_OUTPUT_BUFFER/U_drv_single_channel (C54C.2 C68C.1 C69C.1 IC25C.4), U_OUTPUT_BUFFER/U_drv_single_channel (C54D.2 C68D.1 C69D.1 IC25D.4)
P3V3: FMC_Delay_1ns_4Cha (14 pins), clock_generator (L3.1 L17.1), fmc_connector (11 pins), power_supply (D1.1 IC16.2 IC16.8), acam_tdc (6 pins), U_CHANNEL_DELAY (20 pins), U_CHANNEL_DELAY (20 pins), output_driver (5 pins), U_OUTPUT_BUFFER/U_drv_single_channel (C81A.1 IC26A.5 IC27A.5), U_OUTPUT_BUFFER/U_drv_single_channel (C81B.1 IC26B.5 IC27B.5), U_OUTPUT_BUFFER/U_drv_single_channel (C81C.1 IC26C.5 IC27C.5), U_OUTPUT_BUFFER/U_drv_single_channel (C81D.1 IC26D.5 IC27D.5), input_stage (8 pins), leds_mem_sensor (5 pins)
P3V3_AUX: fmc_connector (J6.d32), leds_mem_sensor (C55.1 IC22.8)
P8V: power_supply (7 pins), acam_tdc (6 pins), U_OUTPUT_BUFFER/U_drv_single_channel (5 pins), U_OUTPUT_BUFFER/U_drv_single_channel (5 pins), U_OUTPUT_BUFFER/U_drv_single_channel (5 pins), U_OUTPUT_BUFFER/U_drv_single_channel (5 pins)
P12V0: fmc_connector (C90.2 C91.2 J6.c35 J6.c37), power_supply (8 pins)
VADJ: fmc_connector (J6.g39 J6.h40), power_supply (R39.1)
CAL_PULSE_BUF: FMC_Delay_1ns_4Cha (IC31.4 R73.1), acam_tdc (IC8.80), input_stage (IC17.1)
CLK1_N: clock_generator (IC4.39), U_CHANNEL_DELAY (IC3A.5 R8A.2)
CLK1_N: clock_generator (IC4.53), U_CHANNEL_DELAY (IC3B.5 R8B.2)
CLK1_P: clock_generator (IC4.40), U_CHANNEL_DELAY (IC3A.4 R10A.2)
CLK1_P: clock_generator (IC4.52), U_CHANNEL_DELAY (IC3B.4 R10B.2)
CLK2_N: clock_generator (IC4.43), U_CHANNEL_DELAY (IC3A.7 R14A.2)
CLK2_N: clock_generator (IC4.56), U_CHANNEL_DELAY (IC3B.7 R14B.2)
CLK2_P: clock_generator (IC4.42), U_CHANNEL_DELAY (IC3A.6 R21A.2)
CLK2_P: clock_generator (IC4.55), U_CHANNEL_DELAY (IC3B.6 R21B.2)
CLK125_N: clock_generator (IC4.35), fmc_connector (J6.g3)
CLK125_P: clock_generator (IC4.36), fmc_connector (J6.g2)
DELAY_D0: fmc_connector (J6.h38), U_CHANNEL_DELAY (IC2A.23 IC7A.2), U_CHANNEL_DELAY (IC2B.23 IC7B.2)
DELAY_D1: fmc_connector (J6.h37), U_CHANNEL_DELAY (IC2A.25 IC7A.1), U_CHANNEL_DELAY (IC2B.25 IC7B.1)
DELAY_D2: fmc_connector (J6.g37), U_CHANNEL_DELAY (IC2A.26 IC7A.32), U_CHANNEL_DELAY (IC2B.26 IC7B.32)
DELAY_D3: fmc_connector (J6.g36), U_CHANNEL_DELAY (IC2A.27 IC7A.31), U_CHANNEL_DELAY (IC2B.27 IC7B.31)
DELAY_D4: fmc_connector (J6.h35), U_CHANNEL_DELAY (IC2A.29 IC7A.30), U_CHANNEL_DELAY (IC2B.29 IC7B.30)
DELAY_D5: fmc_connector (J6.h34), U_CHANNEL_DELAY (IC2A.30 IC7A.29), U_CHANNEL_DELAY (IC2B.30 IC7B.29)
DELAY_D6: fmc_connector (J6.g34), U_CHANNEL_DELAY (IC2A.31 IC7A.27), U_CHANNEL_DELAY (IC2B.31 IC7B.27)
DELAY_D7: fmc_connector (J6.g33), U_CHANNEL_DELAY (IC2A.32 IC7A.26), U_CHANNEL_DELAY (IC2B.32 IC7B.26)
DELAY_D8: fmc_connector (J6.h32), U_CHANNEL_DELAY (IC2A.1 IC7A.25), U_CHANNEL_DELAY (IC2B.1 IC7B.25)
DELAY_D9: fmc_connector (J6.h31), U_CHANNEL_DELAY (IC2A.2 IC7A.23), U_CHANNEL_DELAY (IC2B.2 IC7B.23)
DELAY_LEN1: fmc_connector (J6.h28), U_CHANNEL_DELAY (IC2A.10)
DELAY_LEN2: fmc_connector (J6.h29), U_CHANNEL_DELAY (IC7A.10)
DELAY_LEN3: fmc_connector (J6.g31), U_CHANNEL_DELAY (IC2B.10)
DELAY_LEN4: fmc_connector (J6.g30), U_CHANNEL_DELAY (IC7B.10)
DIN1: fmc_connector (J6.h26), U_CHANNEL_DELAY (R1A.2)
DIN2: fmc_connector (J6.h25), U_CHANNEL_DELAY (R52A.2)
DIN3: fmc_connector (J6.g28), U_CHANNEL_DELAY (R1B.2)
DIN4: fmc_connector (J6.g27), U_CHANNEL_DELAY (R52B.2)
DMTD_CLK: FMC_Delay_1ns_4Cha (IC32.2), fmc_connector (J6.c22)
DMTD_CLK_BUF: FMC_Delay_1ns_4Cha (IC32.4), output_driver (R74.1), U_OUTPUT_BUFFER/U_drv_single_channel (IC27A.2), U_OUTPUT_BUFFER/U_drv_single_channel (IC27B.2), U_OUTPUT_BUFFER/U_drv_single_channel (IC27C.2), U_OUTPUT_BUFFER/U_drv_single_channel (IC27D.2), input_stage (IC24.2)
DMTD_FB_IN: fmc_connector (J6.g7), input_stage (IC24.4)
DMTD_FB_OUT: fmc_connector (J6.c23), output_driver (IC18.4)
EXT_RESET_N: fmc_connector (J6.g22), power_supply (R78.1)
FPGA_TDC_START_N: clock_generator (C24.1), fmc_connector (J6.h5)
FPGA_TDC_START_P: clock_generator (C12.1), fmc_connector (J6.h4)
GA0: fmc_connector (J6.c34), leds_mem_sensor (IC22.2)
GA1: fmc_connector (J6.d35), leds_mem_sensor (IC22.1)
NetF5_1: FMC_Delay_1ns_4Cha (J5.1), input_stage (F5.1)
NetIC1A_6: U_CHANNEL_DELAY (IC1A.6), U_OUTPUT_BUFFER/U_drv_single_channel (IC25C.3 R75C.2)
NetIC1A_7: U_CHANNEL_DELAY (IC1A.7), U_OUTPUT_BUFFER/U_drv_single_channel (IC25D.3 R75D.2)
NetIC1B_6: U_CHANNEL_DELAY (IC1B.6), U_OUTPUT_BUFFER/U_drv_single_channel (IC25A.3 R75A.2)
NetIC1B_7: U_CHANNEL_DELAY (IC1B.7), U_OUTPUT_BUFFER/U_drv_single_channel (IC25B.3 R75B.2)
NetIC4_46: clock_generator (IC4.46), acam_tdc (IC8.56)
NetIC8_4: fmc_connector (J6.g24), acam_tdc (IC8.4)
NetIC8_5: fmc_connector (J6.g25), acam_tdc (IC8.5 IC8.6 IC8.8 IC8.9)
NetIC13_1: fmc_connector (J6.h20), leds_mem_sensor (IC13.1 R58.1)
NetIC15_1: output_driver (IC15.1), U_OUTPUT_BUFFER/U_drv_single_channel (IC27B.4)
NetIC15_2: output_driver (IC15.2), U_OUTPUT_BUFFER/U_drv_single_channel (IC27A.4)
NetIC20_1: output_driver (IC20.1), U_OUTPUT_BUFFER/U_drv_single_channel (IC27D.4)
NetIC20_2: output_driver (IC20.2), U_OUTPUT_BUFFER/U_drv_single_channel (IC27C.4)
NetIC31_2: FMC_Delay_1ns_4Cha (IC31.2), fmc_connector (J6.h22)
NetJ1_1: FMC_Delay_1ns_4Cha (J1.1), U_OUTPUT_BUFFER/U_drv_single_channel (R65A.1 R72A.2)
NetJ2_1: FMC_Delay_1ns_4Cha (J2.1), U_OUTPUT_BUFFER/U_drv_single_channel (R65B.1 R72B.2)
NetJ3_1: FMC_Delay_1ns_4Cha (J3.1), U_OUTPUT_BUFFER/U_drv_single_channel (R65C.1 R72C.2)
NetJ4_1: FMC_Delay_1ns_4Cha (J4.1), U_OUTPUT_BUFFER/U_drv_single_channel (R65D.1 R72D.2)
NetJ6_g18: fmc_connector (J6.g18), acam_tdc (RN4.9)
NetJ6_g19: fmc_connector (J6.g19), acam_tdc (RN4.11)
NetJ6_h19: fmc_connector (J6.h19), leds_mem_sensor (T3.1)
OUT_EN1: FMC_Delay_1ns_4Cha (IC19.22), U_OUTPUT_BUFFER/U_drv_single_channel (IC26A.1 R42A.1)
OUT_EN2: FMC_Delay_1ns_4Cha (IC19.21), U_OUTPUT_BUFFER/U_drv_single_channel (IC26B.1 R42B.1)
OUT_EN3: FMC_Delay_1ns_4Cha (IC19.20), U_OUTPUT_BUFFER/U_drv_single_channel (IC26C.1 R42C.1)
OUT_EN4: FMC_Delay_1ns_4Cha (IC19.19), U_OUTPUT_BUFFER/U_drv_single_channel (IC26D.1 R42D.1)
PLL_STATUS: clock_generator (IC4.6), fmc_connector (J6.h23)
RESETn: FMC_Delay_1ns_4Cha (IC19.14), clock_generator (IC4.23), power_supply (IC16.5), acam_tdc (IC8.67)
SCL: fmc_connector (J6.c30), leds_mem_sensor (IC22.6)
SDA: fmc_connector (J6.c31), leds_mem_sensor (IC22.5)
SPI_DAC_CSN: clock_generator (IC14.5), fmc_connector (J6.d24)
SPI_IO_CSN_2V5: FMC_Delay_1ns_4Cha (IC12.2), fmc_connector (J6.g21)
SPI_MISO: FMC_Delay_1ns_4Cha (R68.2), clock_generator (R114.2), fmc_connector (J6.c27)
SPI_MOSI_2V5: FMC_Delay_1ns_4Cha (IC29.2), fmc_connector (J6.c26)
SPI_MOSI_3V3: FMC_Delay_1ns_4Cha (IC19.9 IC29.4), clock_generator (IC4.22 IC14.7)
SPI_PLL_CSN: clock_generator (IC4.17), fmc_connector (J6.d27)
SPI_SCK_2V5: FMC_Delay_1ns_4Cha (IC28.2), fmc_connector (J6.d26)
SPI_SCK_3V3: FMC_Delay_1ns_4Cha (IC19.8 IC28.4), clock_generator (IC4.16 IC14.6)
TDC_ADR0: FMC_Delay_1ns_4Cha (IC19.25), acam_tdc (IC8.74)
TDC_ADR1: FMC_Delay_1ns_4Cha (IC19.26), acam_tdc (IC8.73)
TDC_ADR2: FMC_Delay_1ns_4Cha (IC19.27), acam_tdc (IC8.72)
TDC_ADR3: FMC_Delay_1ns_4Cha (IC19.28), acam_tdc (IC8.71)
TDC_CAL_STOP1: acam_tdc (IC8.99), U_OUTPUT_BUFFER/U_drv_single_channel (IC26A.4)
TDC_CAL_STOP2: acam_tdc (IC8.3), U_OUTPUT_BUFFER/U_drv_single_channel (IC26B.4)
TDC_CAL_STOP3: acam_tdc (IC8.7), U_OUTPUT_BUFFER/U_drv_single_channel (IC26C.4)
TDC_CAL_STOP4: acam_tdc (IC8.11), U_OUTPUT_BUFFER/U_drv_single_channel (IC26D.4)
TDC_D0: fmc_connector (J6.d9), acam_tdc (RN1.9)
TDC_D1: fmc_connector (J6.h11), acam_tdc (RN1.10)
TDC_D2: fmc_connector (J6.d8), acam_tdc (RN1.11)
TDC_D3: fmc_connector (J6.h10), acam_tdc (RN1.12)
TDC_D4: fmc_connector (J6.g10), acam_tdc (RN1.13)
TDC_D5: fmc_connector (J6.g9), acam_tdc (RN1.14)
TDC_D6: fmc_connector (J6.h8), acam_tdc (RN1.15)
TDC_D7: fmc_connector (J6.h7), acam_tdc (RN1.16)
TDC_D8: fmc_connector (J6.c10), acam_tdc (RN2.16)
TDC_D9: fmc_connector (J6.c11), acam_tdc (RN2.15)
TDC_D10: fmc_connector (J6.g12), acam_tdc (RN2.14)
TDC_D11: fmc_connector (J6.g13), acam_tdc (RN2.13)
TDC_D12: fmc_connector (J6.d11), acam_tdc (RN2.12)
TDC_D13: fmc_connector (J6.d12), acam_tdc (RN2.11)
TDC_D14: fmc_connector (J6.h13), acam_tdc (RN2.10)
TDC_D15: fmc_connector (J6.h14), acam_tdc (RN2.9)
TDC_D16: fmc_connector (J6.d14), acam_tdc (RN3.16)
TDC_D17: fmc_connector (J6.d15), acam_tdc (RN3.15)
TDC_D18: fmc_connector (J6.c14), acam_tdc (RN3.14)
TDC_D19: fmc_connector (J6.c15), acam_tdc (RN3.13)
TDC_D20: fmc_connector (J6.g15), acam_tdc (RN3.12)
TDC_D21: fmc_connector (J6.g16), acam_tdc (RN3.11)
TDC_D22: fmc_connector (J6.h16), acam_tdc (RN3.10)
TDC_D23: fmc_connector (J6.h17), acam_tdc (RN3.9)
TDC_D24: fmc_connector (J6.d17), acam_tdc (RN4.15)
TDC_D25: fmc_connector (J6.d18), acam_tdc (RN4.14)
TDC_D26: fmc_connector (J6.c18), acam_tdc (RN4.13)
TDC_D27: fmc_connector (J6.c19), acam_tdc (RN4.12)
TDC_OEN: fmc_connector (J6.d23), acam_tdc (IC8.63)
TDC_RDN: fmc_connector (J6.d21), acam_tdc (IC8.15)
TDC_START_N: clock_generator (IC4.26), acam_tdc (IC8.92 R50.2)
TDC_START_P: clock_generator (IC4.25), acam_tdc (IC8.93 R49.2)
TDC_STOP_N: acam_tdc (IC8.96 R47.2), input_stage (IC5.3)
TDC_STOP_P: acam_tdc (IC8.97 R46.2), input_stage (IC5.2)
TDC_WRN: fmc_connector (J6.d20), acam_tdc (IC8.13)
TERM_ENABLE: FMC_Delay_1ns_4Cha (IC19.17), input_stage (R76.1 T2.1), leds_mem_sensor (T1.1)
TRIG_SEL: FMC_Delay_1ns_4Cha (IC19.23), input_stage (IC17.9 R107.1)
TRIG_TO_FPGA: fmc_connector (J6.g6), input_stage (R109.1)